# Altium schematic sheet STM32.SchDoc
size A; SheetNumber: 3; SheetTotal: 5
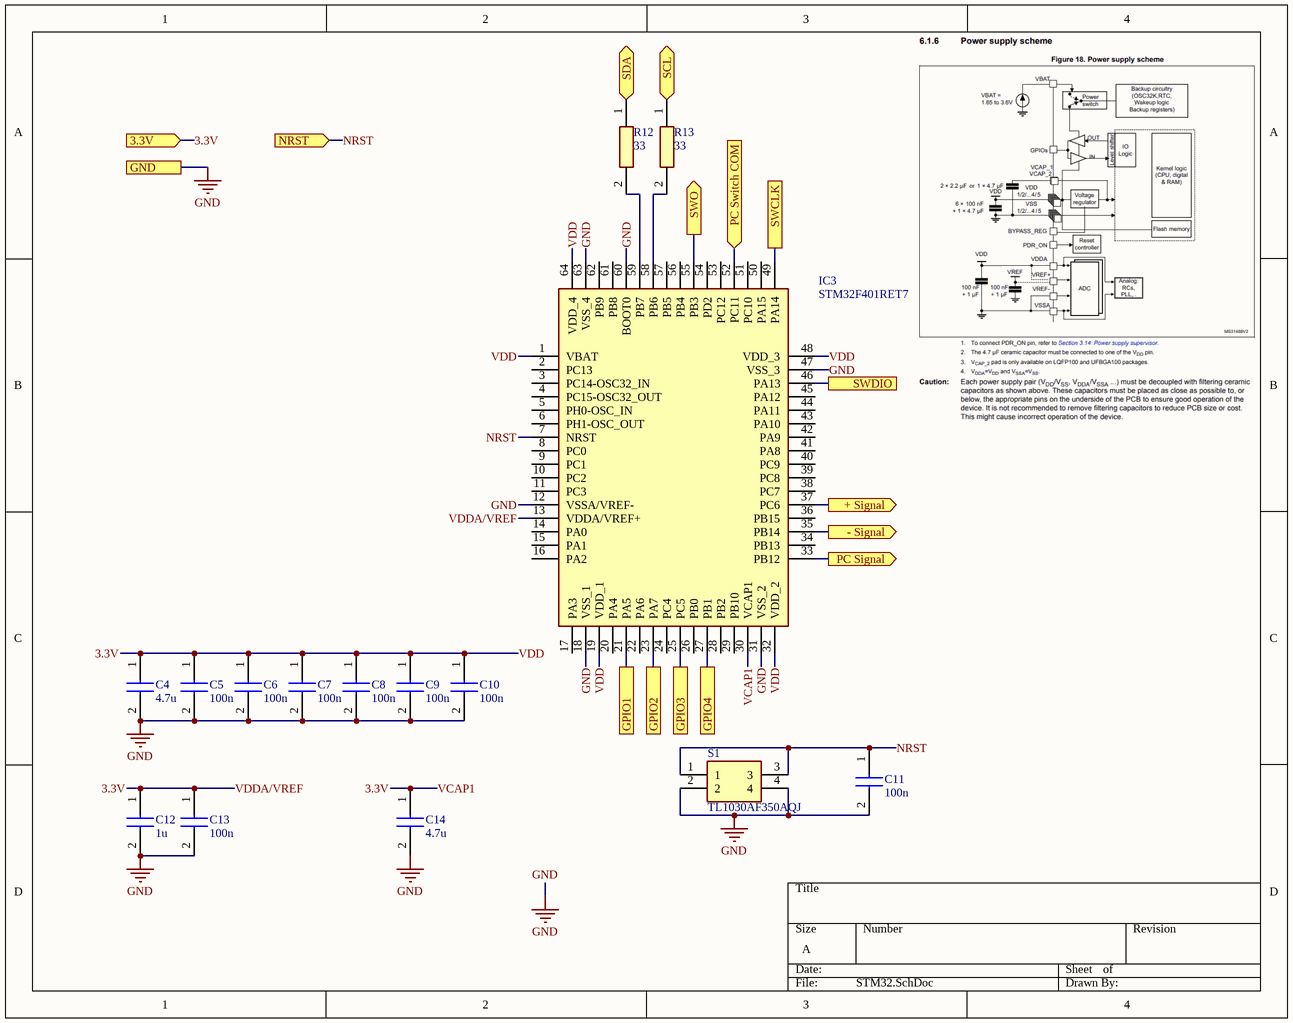
[diagram p0: STM32.SchDoc]

## Parts
C4  4.7u  [CAPC3216X180N]
C5  100n  [CAPC3216X94N]
C6  100n  [CAPC3216X94N]
C7  100n  [CAPC3216X94N]
C8  100n  [CAPC3216X94N]
C9  100n  [CAPC3216X94N]
C10  100n  [CAPC3216X94N]
C11  100n  [CAPC3216X94N]
C12  1u  [CAPC3216X180N]
C13  100n  [CAPC3216X94N]
C14  4.7u  [CAPC3216X180N]
IC3  STM32F401RET7  [QFP50P1200X1200X160-64N]
R12  33  [ERJ8ENF1000V]
R13  33  [ERJ8ENF1000V]
S1  TL1030AF350AQJ  [TL1030AF350AQJ]

## Ports
3.3V (in), + Signal (out), - Signal (out), GND, GPIO1, GPIO2, GPIO3, GPIO4, NRST (in), PC Signal (out), PC Switch COM (in), SCL (bidir), SDA (bidir), SWCLK, SWDIO, SWO (out)

## Nets
GND: C4.2 C5.2 C6.2 C7.2 C8.2 C9.2 C10.2 C11.2 C12.2 C13.2 C14.2 IC3.12(VSSA/VREF-) IC3.18(VSS_1) IC3.31(VSS_2) IC3.47(VSS_3) IC3.60(BOOT0) IC3.63(VSS_4) S1.2 S1.4 ; port GND
3.3V: C4.1 C5.1 C6.1 C7.1 C8.1 C9.1 C10.1 C12.1 C13.1 C14.1 IC3.1(VBAT) IC3.13(VDDA/VREF+) IC3.19(VDD_1) IC3.30(VCAP1) IC3.32(VDD_2) IC3.48(VDD_3) IC3.64(VDD_4) ; port 3.3V  [also labelled VCAP1, VDD, VDDA/VREF]
+ Signal: IC3.37(PC6) ; port + Signal
- Signal: IC3.35(PB14) ; port - Signal
GPIO1: IC3.21(PA5) ; port GPIO1
GPIO2: IC3.23(PA7) ; port GPIO2
GPIO3: IC3.25(PC5) ; port GPIO3
GPIO4: IC3.27(PB1) ; port GPIO4
NRST: C11.1 IC3.7(NRST) S1.1 S1.3 ; port NRST
PC Signal: IC3.33(PB12) ; port PC Signal
PC Switch COM: IC3.52(PC11) ; port PC Switch COM
SCL: R13.1 ; port SCL
SDA: R12.1 ; port SDA
SWCLK: IC3.49(PA14) ; port SWCLK
SWDIO: IC3.46(PA13) ; port SWDIO
SWO: IC3.55(PB3) ; port SWO
NetIC3_58: IC3.58(PB6) R13.2
NetIC3_59: IC3.59(PB7) R12.2

Not connected (* = marked no-connect by the designer): IC3 2(PC13) 3(PC14-OSC32_IN) 4(PC15-OSC32_OUT) 5(PH0-OSC_IN) 6(PH1-OSC_OUT) 8(PC0) 9(PC1) 10(PC2) 11(PC3) 14(PA0) 15(PA1) 16(PA2) 17(PA3) 20(PA4) 22(PA6) 24(PC4) 26(PB0) 28(PB2) 29(PB10) 34(PB13) 36(PB15) 38(PC7) 39(PC8) 40(PC9) 41(PA8) 42(PA9) 43(PA10) 44(PA11) 45(PA12) 50(PA15) 51(PC10) 53(PC12) 54(PD2) 56(PB4) 57(PB5) 61(PB8) 62(PB9)

## Library data of the parts
C4 C14 = GMK316AB7475KLHT: Capacitor; Manufacturer_Name: TAIYO YUDEN; Datasheet Link: https://ds.yuden.co.jp/TYCOMPAS/ap/specSheet?pn=MMASG31LAB7475KTNA01; Height: 1.8mm; Manufacturer_Part_Number: GMK316AB7475KLHT; Mouser Part Number: 963-GMK316AB7475KLHT; Mouser Price/Stock: https://www.mouser.co.uk/ProductDetail/TAIYO-YUDEN/GMK316AB7475KLHT?qs=CNQs48zzdnoeKLJ9%2F6WNWQ%3D%3D; Arrow Part Number: GMK316AB7475KLHT; Arrow Price/Stock: https://www.arrow.com/en/products/gmk316ab7475klht/taiyo-yuden?utm_currency=USD&region=nac
C5-C11 C13 = 12065C104J4Z2A: Capacitor; Manufacturer_Name: Kyocera AVX; Datasheet Link: https://spicat.kyocera-avx.com/product/mlcc/chartview/12065C104J4Z2A/DataSheet/X7R; Height: 0.94mm; Manufacturer_Part_Number: 12065C104J4Z2A; Mouser Part Number: 581-12065C104J4Z2A; Mouser Price/Stock: https://www.mouser.com/Search/Refine.aspx?Keyword=581-12065C104J4Z2A
C12 = HMK316B7105KLHT: Capacitor; Manufacturer_Name: TAIYO YUDEN; Datasheet Link: https://mouser.componentsearchengine.com/Datasheets/1/HMK316B7105KLHT.pdf; Height: 1.8mm; Manufacturer_Part_Number: HMK316B7105KLHT; Mouser Part Number: 963-HMK316B7105KLHT; Mouser Price/Stock: https://www.mouser.co.uk/ProductDetail/TAIYO-YUDEN/HMK316B7105KLHT?qs=sz8xDBnIhcFmvpGfTAF0nQ%3D%3D; Arrow Part Number: HMK316B7105KLHT; Arrow Price/Stock: null?utm_currency=USD&region=nac
IC3 = STM32F401RET7: Integrated Circuit; Manufacturer_Name: STMicroelectronics; Datasheet Link: https://www.arrow.com/en/products/stm32f401ret7/stmicroelectronics; Height: 1.6mm; Manufacturer_Part_Number: STM32F401RET7; Mouser Part Number: 511-STM32F401RET7; Mouser Price/Stock: https://www.mouser.co.uk/ProductDetail/STMicroelectronics/STM32F401RET7?qs=aVyJF2WnouSdX21y3k%2FIAA%3D%3D; Arrow Part Number: STM32F401RET7; Arrow Price/Stock: https://www.arrow.com/en/products/stm32f401ret7/stmicroelectronics?utm_currency=USD&region=nac
R12 R13 = ERJ-8ENF33R0V: Resistor; Manufacturer_Name: Panasonic; Datasheet Link: https://industrial.panasonic.com/cdbs/www-data/pdf/RDA0000/AOA0000C86.pdf; Height: 0.7mm; Manufacturer_Part_Number: ERJ-8ENF33R0V; Mouser Part Number: 667-ERJ-8ENF33R0V; Mouser Price/Stock: https://www.mouser.co.uk/ProductDetail/Panasonic/ERJ-8ENF33R0V?qs=8%252BG0TiN%2FgVpb1yH%2F8k6uQg%3D%3D
S1 = TL1030AF350AQJ: Switch; Manufacturer_Name: E-Switch; Datasheet Link: https://configured-product-images.s3.amazonaws.com/2D/specs/TL1030AF350AQJ.pdf; Height: 1.95mm; Manufacturer_Part_Number: TL1030AF350AQJ; Mouser Part Number: 612-TL1030AF350AQJ; Mouser Price/Stock: https://www.mouser.co.uk/ProductDetail/E-Switch/TL1030AF350AQJ?qs=VVKQmw408U%2FgalG8VZqjEg%3D%3D